# Altium schematic sheet F44.SchDoc
size A4
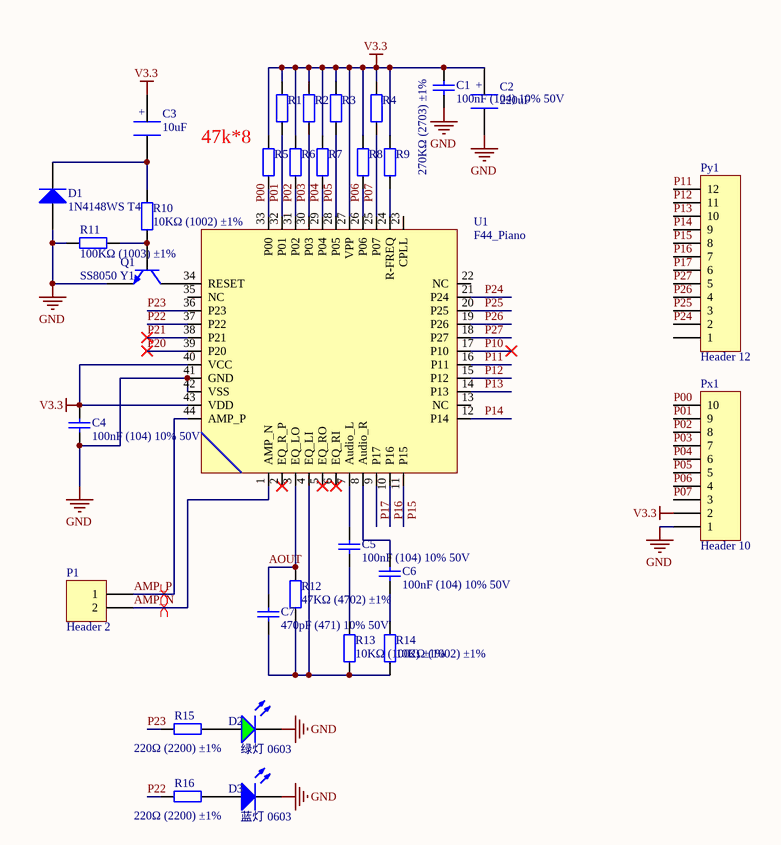
[diagram p0: F44.SchDoc]

## Parts
C1  100nF (104) 10% 50V  [0603_C]
C2  220uF  [8X12_CAP]
C3  10uF  [HDR1X2]
C4  100nF (104) 10% 50V  [0603_C]
C5  100nF (104) 10% 50V  [0603_C]
C6  100nF (104) 10% 50V  [0603_C]
C7  470pF (471) 10% 50V  [0603_C]
D1  1N4148WS T4  [SOD-323]
D2  绿灯 0603  [0603_LED_S1]
D3  蓝灯 0603  [0603_LED_S1]
P1  Header 2  [XH2.54-WS-2P]
Px1  Header 10  [FPC1.0-2H-WS-10P]
Py1  Header 12  [FPC1.0-2H-WS-12P]
Q1  SS8050 Y1  [SOT-23(SOT-23-3)]
R1  47KΩ (4702) ±1%  [0603_R]  (value not drawn)
R2  47KΩ (4702) ±1%  [0603_R]  (value not drawn)
R3  47KΩ (4702) ±1%  [0603_R]  (value not drawn)
R4  47KΩ (4702) ±1%  [0603_R]  (value not drawn)
R5  47KΩ (4702) ±1%  [0603_R]  (value not drawn)
R6  47KΩ (4702) ±1%  [0603_R]  (value not drawn)
R7  47KΩ (4702) ±1%  [0603_R]  (value not drawn)
R8  47KΩ (4702) ±1%  [0603_R]  (value not drawn)
R9  270KΩ (2703) ±1%  [0603_R]
R10  10KΩ (1002) ±1%  [0603_R]
R11  100KΩ (1003) ±1%  [0603_R]
R12  47KΩ (4702) ±1%  [0603_R]
R13  10KΩ (1002) ±1%  [0603_R]
R14  10KΩ (1002) ±1%  [0603_R]
R15  220Ω (2200) ±1%  [0603_R]
R16  220Ω (2200) ±1%  [0603_R]
U1  F44_Piano  [LQFP-44_10x10x08P]

## Nets
GND: C1.1 C2.2 C4.2 D1.1(A) D2.K D3.K Px1.1 Q1.2(E) R11.1 U1.41(GND) U1.42(VSS)
V3.3: C1.2 C2.1 C3.1 C4.1 Px1.2 R1.2 R2.2 R3.2 R4.2 R5.2 R6.2 R7.2 R8.2 R9.2 U1.27(VPP) U1.40(VCC) U1.43(VDD)
AMP_N: P1.2 U1.1(AMP_N)
AMP_P: P1.1 U1.44(AMP_P)
AOUT: C7.2 R12.2 U1.3(EQ_LO)
P00: Px1.10 R5.1 U1.33(P00)
P01: Px1.9 R1.1 U1.32(P01)
P02: Px1.8 R6.1 U1.31(P02)
P03: Px1.7 R2.1 U1.30(P03)
P04: Px1.6 R7.1 U1.29(P04)
P05: Px1.5 R3.1 U1.28(P05)
P06: Px1.4 R8.1 U1.26(P06)
P07: Px1.3 R4.1 U1.25(P07)
P10: U1.17(P10)
P11: Py1.12 U1.16(P11)
P12: Py1.11 U1.15(P12)
P13: Py1.10 U1.14(P13)
P14: Py1.9 U1.12(P14)
P15: Py1.8 U1.11(P15)
P16: Py1.7 U1.10(P16)
P17: Py1.6 U1.9(P17)
P20: U1.39(P20)
P21: U1.38(P21)
P22: R16.1 U1.37(P22)
P23: R15.1 U1.36(P23)
P24: Py1.2 U1.21(P24)
P25: Py1.3 U1.20(P25)
P26: Py1.4 U1.19(P26)
P27: Py1.5 U1.18(P27)
NetC3_2: C3.2 D1.2(K) R10.2
NetC5_1: C5.1 R13.2
NetC5_2: C5.2 U1.7(Audio_L)
NetC6_1: C6.1 R14.2
NetC6_2: C6.2 U1.8(Audio_R)
NetC7_1: C7.1 R12.1 R13.1 R14.1 U1.4(EQ_LI)
NetD2_A: D2.A R15.2
NetD3_A: D3.A R16.2
NetQ1_1: Q1.1(B) R10.1 R11.2
NetQ1_3: Q1.3(C) U1.34(RESET)
NetR9_1: R9.1 U1.24(R-FREQ)

Not connected (* = marked no-connect by the designer): Py1 1; U1 2(EQ_R_P)* 5(EQ_RO)* 6(EQ_RI)* 13(NC) 22(NC) 23(CPLL) 35(NC)

## Layout directives
differential pair: AMP_N, AMP_P

## Notes on the sheet
- (near R5) 47k*8
- (in symbol CAP) +

## Library data of the parts
C1 C4-C6 = 0603 100nF (104) 10% 50V: 贴片电容; ComponentLink1Description: 供应商链接; ComponentLink1URL: http://www.szlcsc.com/product/details_15331.html; Package: 0603; Supplier: LC; SuppliersPartNumber: C14663
C2 C3 = CAP
C7 = 0603 470pF (471) 10% 50V: 贴片电容; ComponentLink1Description: 供应商链接; ComponentLink1URL: http://www.szlcsc.com/product/details_1972.html; Package: 0603; Supplier: LC; SuppliersPartNumber: C1620
D1 = SOD-323 1N4148WS T4: 二极管; ComponentLink1Description: 供应商链接; ComponentLink1URL: http://www.szlcsc.com/product/details_2485.html; Package: SOD-323; Supplier: LC; SuppliersPartNumber: C2128
D2 = 0603 绿灯: 发光二极管; ComponentLink1Description: 供应商链接; ComponentLink1URL: http://www.szlcsc.com/product/details_73152.html; Package: 0603; Supplier: LC; SuppliersPartNumber: C72043
D3 = 0603 蓝灯: 发光二极管; ComponentLink1Description: 供应商链接; ComponentLink1URL: http://www.szlcsc.com/product/details_73150.html; Package: 0603; Supplier: LC; SuppliersPartNumber: C72041
P1 = Header 2: Header, 2-Pin; LatestRevisionDate: 17-Jul-2002; LatestRevisionNote: Re-released for DXP Platform.; Publisher: Altium Limited
Px1 = Header 10: Header, 10-Pin; LatestRevisionDate: 17-Jul-2002; LatestRevisionNote: Re-released for DXP Platform.; Publisher: Altium Limited
Py1 = Header 12: Header, 12-Pin; LatestRevisionDate: 17-Jul-2002; LatestRevisionNote: Re-released for DXP Platform.; Publisher: Altium Limited
Q1 = SOT-23 SS8050 Y1: 三极管; ComponentLink1Description: 供应商链接; ComponentLink1URL: http://www.szlcsc.com/product/details_2507.html; Package: SOT-23; Supplier: LC; SuppliersPartNumber: C2150
R1-R8 R12 = 0603 47KΩ (4702) 1%: 贴片电阻; ComponentLink1Description: 供应商链接; ComponentLink1URL: http://www.szlcsc.com/product/details_26562.html; Package: 0603; Supplier: LC; SuppliersPartNumber: C25819
R9 = 0603 270KΩ (2703) 1%: 贴片电阻; ComponentLink1Description: 供应商链接; ComponentLink1URL: http://www.szlcsc.com/product/details_23692.html; Package: 0603; Supplier: LC; SuppliersPartNumber: C22965
R10 R13 R14 = 0603 10KΩ (1002) 1%: 贴片电阻; ComponentLink1Description: 供应商链接; ComponentLink1URL: http://www.szlcsc.com/product/details_26547.html; Package: 0603; Supplier: LC; SuppliersPartNumber: C25804
R11 = 0603 100KΩ (1003) 1%: 贴片电阻; ComponentLink1Description: 供应商链接; ComponentLink1URL: http://www.szlcsc.com/product/details_26546.html; Package: 0603; Supplier: LC; SuppliersPartNumber: C25803
R15 R16 = 0603 220Ω (2200) 1%: 贴片电阻; ComponentLink1Description: 供应商链接; ComponentLink1URL: http://www.szlcsc.com/product/details_23689.html; Package: 0603; Supplier: LC; SuppliersPartNumber: C22962